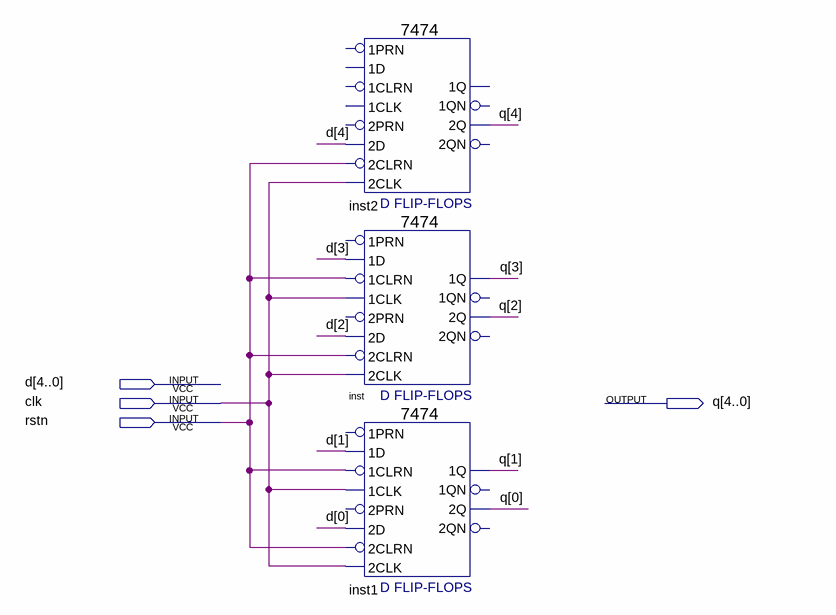
[diagram p0: schematic sheet]
// Quartus schematic Reg5.bdf as structural Verilog: 3 symbols, 4 pins
module Reg5 (
  input  [4:0] d,
  input  clk,
  input  rstn,
  output [4:0] q
);

  \7474  inst2 (
    .\2D (d[4]), .\2CLK (clk), .\2CLRN (rstn), .\2Q (q[4]));  // open: 2PRN, 1CLK, 1D, 1PRN, 1CLRN, 1QN, 2QN, 1Q
  \7474  inst (
    .\2D (d[2]), .\1CLK (clk), .\1D (d[3]), .\2CLK (clk), .\2CLRN (rstn), .\1CLRN (rstn), .\2Q (q[2]),
    .\1Q (q[3]));  // open: 2PRN, 1PRN, 1QN, 2QN
  \7474  inst1 (
    .\2D (d[0]), .\1CLK (clk), .\1D (d[1]), .\2CLK (clk), .\2CLRN (rstn), .\1CLRN (rstn), .\2Q (q[0]),
    .\1Q (q[1]));  // open: 2PRN, 1PRN, 1QN, 2QN
endmodule
